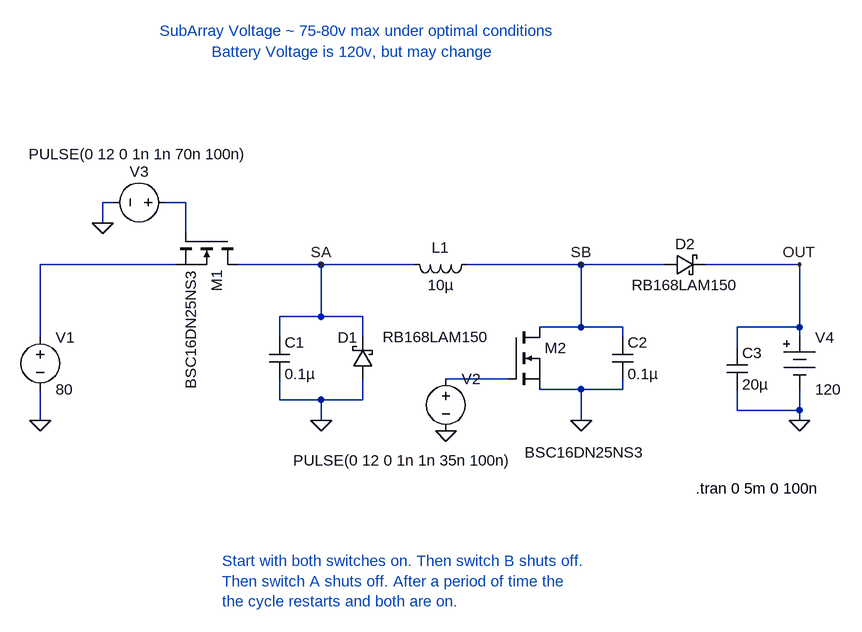
[diagram p0: schematic Working ZVS Converter.asc]
Working ZVS Converter.asc, the LTspice schematic file:
Version 4
SHEET 1 1172 680
WIRE 0 -96 -16 -96
WIRE 112 -96 80 -96
WIRE -16 -64 -16 -96
WIRE 112 -48 112 -96
WIRE 96 0 -112 0
WIRE 320 0 192 0
WIRE 464 0 320 0
WIRE 720 0 544 0
WIRE 848 0 720 0
WIRE 1056 0 912 0
WIRE 320 80 320 0
WIRE 320 80 256 80
WIRE 384 80 320 80
WIRE 720 96 720 0
WIRE 720 96 656 96
WIRE 784 96 720 96
WIRE 1056 96 1056 0
WIRE 1056 96 960 96
WIRE -112 112 -112 0
WIRE 256 112 256 80
WIRE 384 112 384 80
WIRE 784 112 784 96
WIRE 1056 112 1056 96
WIRE 960 128 960 96
WIRE 608 176 512 176
WIRE 720 192 656 192
WIRE 784 192 784 176
WIRE 784 192 720 192
WIRE 256 208 256 176
WIRE 320 208 256 208
WIRE 384 208 384 176
WIRE 384 208 320 208
WIRE 960 224 960 192
WIRE 1056 224 1056 192
WIRE 1056 224 960 224
WIRE -112 240 -112 192
WIRE 320 240 320 208
WIRE 720 240 720 192
WIRE 1056 240 1056 224
FLAG 320 240 0
FLAG -112 240 0
FLAG 720 240 0
FLAG -16 -64 0
FLAG 512 256 0
FLAG 1056 240 0
FLAG 1056 0 OUT
FLAG 720 0 SB
FLAG 320 0 SA
SYMBOL voltage -112 96 R0
WINDOW 123 0 0 Left 0
WINDOW 39 0 0 Left 0
SYMATTR InstName V1
SYMATTR Value 80
SYMBOL nmos 192 -48 R90
SYMATTR InstName M1
SYMATTR Value BSC16DN25NS3
SYMBOL nmos 608 96 R0
WINDOW 3 25 193 Left 2
SYMATTR Value BSC16DN25NS3
SYMATTR InstName M2
SYMBOL schottky 848 16 R270
WINDOW 0 32 32 VTop 2
WINDOW 3 0 32 VBottom 2
SYMATTR InstName D2
SYMATTR Value RB168LAM150
SYMATTR Description Diode
SYMATTR Type diode
SYMBOL cap 240 112 R0
SYMATTR InstName C1
SYMATTR Value 0.1µ
SYMBOL cap 768 112 R0
SYMATTR InstName C2
SYMATTR Value 0.1µ
SYMBOL voltage 512 160 R0
WINDOW 3 -235 141 Left 2
WINDOW 123 0 0 Left 0
WINDOW 39 0 0 Left 0
SYMATTR Value PULSE(0 12 0 1n 1n 35n 100n)
SYMATTR InstName V2
SYMBOL voltage 96 -96 R90
WINDOW 0 -32 56 VBottom 2
WINDOW 3 -90 57 VTop 2
WINDOW 123 0 0 Left 0
WINDOW 39 0 0 Left 0
SYMATTR InstName V3
SYMATTR Value PULSE(0 12 0 1n 1n 70n 100n)
SYMBOL schottky 400 176 R180
WINDOW 0 24 64 Left 2
WINDOW 3 -178 65 Left 2
SYMATTR InstName D1
SYMATTR Value RB168LAM150
SYMATTR Description Diode
SYMATTR Type diode
SYMBOL ind 560 -16 R90
WINDOW 0 5 56 VBottom 2
WINDOW 3 32 56 VTop 2
SYMATTR InstName L1
SYMATTR Value 10µ
SYMBOL cap 944 128 R0
SYMATTR InstName C3
SYMATTR Value 20µ
SYMBOL Misc\\battery 1056 96 R0
SYMATTR InstName V4
SYMATTR Value 120
TEXT 72 -360 Left 2 ;SubArray Voltage ~ 75-80v max under optimal conditions
TEXT 152 -328 Left 2 ;Battery Voltage is 120v, but may change
TEXT 168 456 Left 2 ;Start with both switches on. Then switch B shuts off.\nThen switch A shuts off. After a period of time the\nthe cycle restarts and both are on.
TEXT 896 344 Left 2 !.tran 0 5m 0 100n

The netlist it stands for:
* Working ZVS Converter.asc
V1 N002 0 80
M1 SA N001 N002 N002 BSC16DN25NS3
M2 SB N003 0 0 BSC16DN25NS3
D2 SB OUT RB168LAM150
C1 SA 0 0.1µ
C2 SB 0 0.1µ
V2 N003 0 PULSE(0 12 0 1n 1n 35n 100n)
V3 N001 0 PULSE(0 12 0 1n 1n 70n 100n)
D1 0 SA RB168LAM150
L1 SB SA 10µ
C3 OUT 0 20µ
V4 OUT 0 120
.model D D
.lib standard.dio
.model NMOS NMOS
.model PMOS PMOS
.lib standard.mos
* SubArray Voltage ~ 75-80v max under optimal conditions
* Battery Voltage is 120v, but may change
* Start with both switches on. Then switch B shuts off.
* Then switch A shuts off. After a period of time the
* the cycle restarts and both are on.
.tran 0 5m 0 100n
.backanno
.end